# EAGLE schematic mc34063 (EAGLE 6.3)

## Sheet 1 of 2

## Sheet 2 of 2
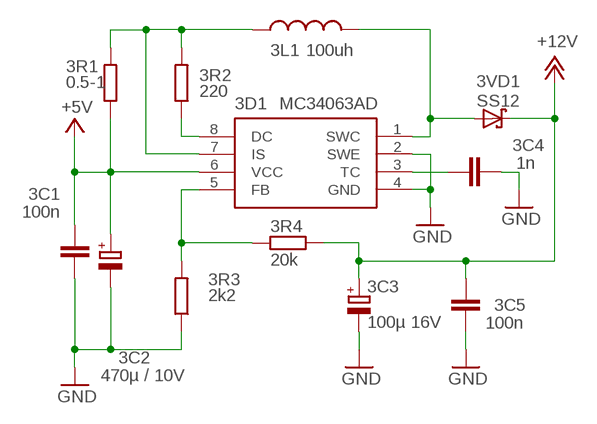
[diagram p0: schematic, sheet 2]

### Parts
3C1  100n  C-EU025-024X044  [C025-024X044]
3C2  470µ / 10V  RCL_CPOL-EUE3.5-8  [RCL_E3,5-8]
3C3  100µ 16V  RCL_CPOL-EUE3.5-8  [RCL_E3,5-8]
3C4  1n  C-EU025-025X050  [C025-025X050]
3C5  100n  C-EU025-025X050  [C025-025X050]
3D1  MC34063AD  [SOIC8]
3L1  100uh  L-US0207/10  [0207/10]
3R1  0.5-1  R-EU_0204/7  [0204/7]
3R2  220  R-EU_0204/7  [0204/7]
3R3  2k2  R-EU_M0805  [M0805]
3R4  20k  R-EU_M0805  [M0805]
3VD1  SS12  SCHOTTKY-DIODESMD  [SMB]

### Nets
+5V: 3C1.1 3C2.+ 3D1.6(VCC) 3R1.1
+12V: 3C3.+ 3C5.2 3R4.2 3VD1.C
GND: 3C1.2 3C2.- 3C3.- 3C4.2 3C5.1 3D1.2(SWE) 3D1.4(GND) 3R3.1
N$104: 3D1.8(DC) 3R2.1
N$105: 3D1.7(IS) 3L1.1 3R1.2 3R2.2
N$106: 3D1.5(FB) 3R3.2 3R4.1
N$107: 3D1.1(SWC) 3L1.2 3VD1.A
N$108: 3C4.1 3D1.3(TC)

## Library data of the parts
3C1 = rc-elektronik:C-EU: CAPACITOR, European symbol
3C2 3C3 = HWProgUSB:RCL_CPOL-EU: POLARIZED CAPACITOR, European symbol
3C4 3C5 = rcl:C-EU: CAPACITOR, European symbol
3D1 = mc34063:MC34063
3L1 = rcl:L-US: INDUCTOR, American symbol
3R1-3R4 = rcl:R-EU_: RESISTOR, European symbol
3VD1 = diode:SCHOTTKY-DIODE: Schottky Diode